# Altium schematic sheet Power_Sensing.SchDoc
size A4; DocumentNumber: 2; SheetNumber: 2; SheetTotal: 7
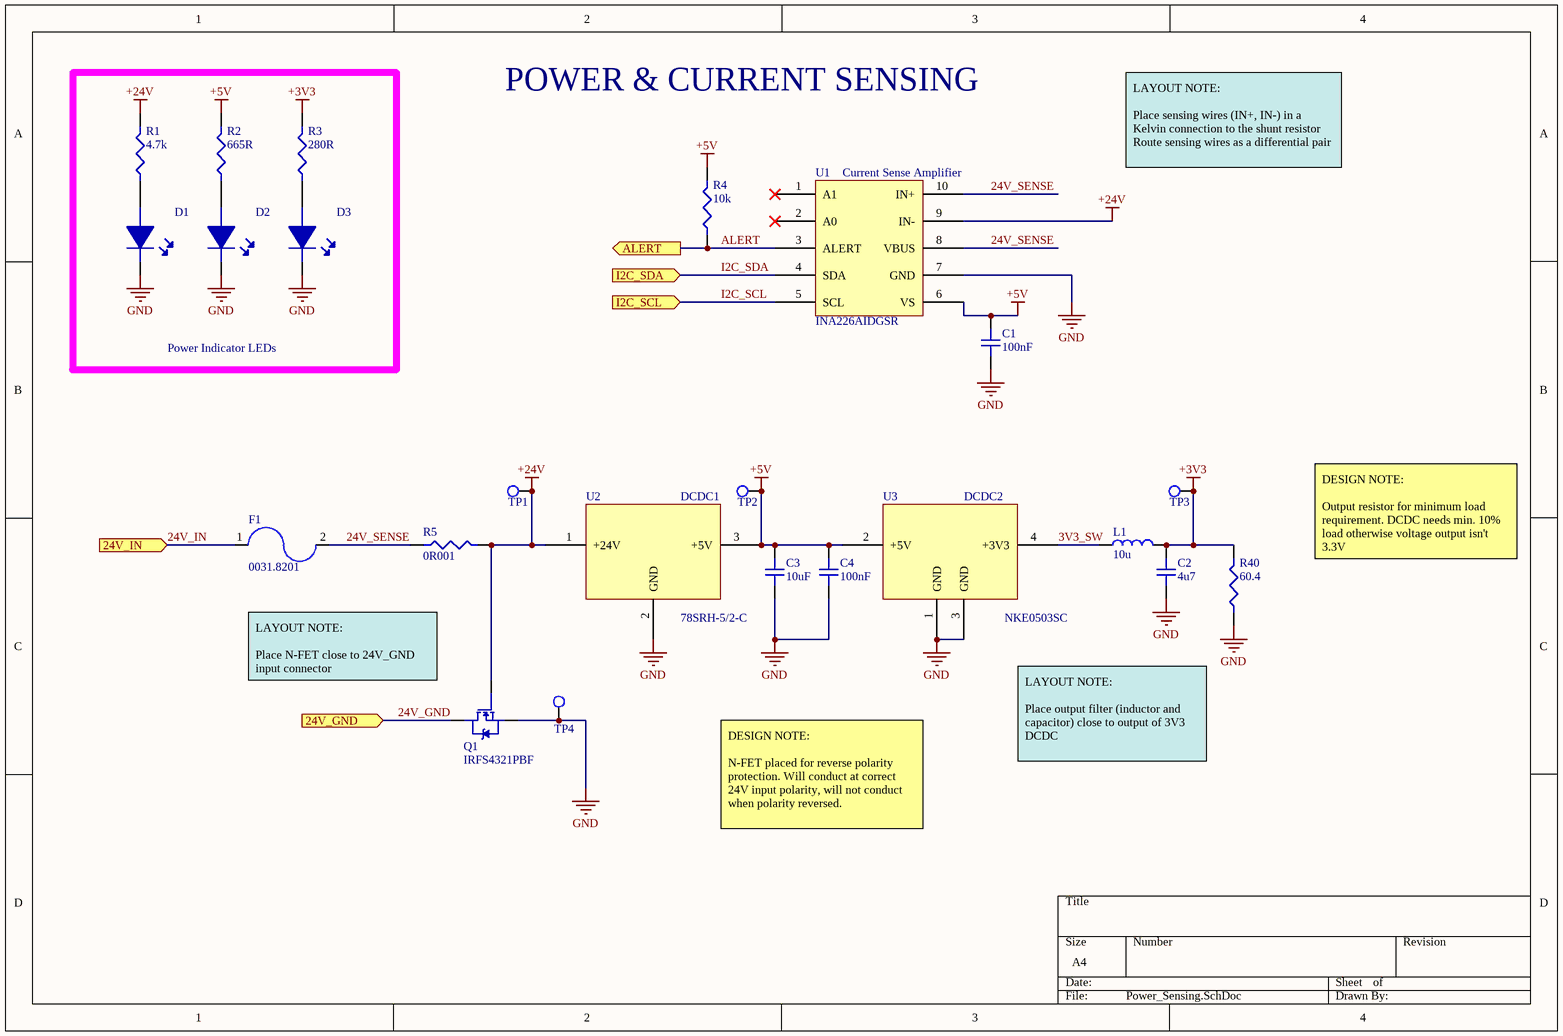
[diagram p0: Power_Sensing.SchDoc]

## Parts
C1  100nF  [C0805]
C2  4u7  [C0805]
C3  10uF  [TANT_10u]
C4  100nF  [C0805]
D1  LTST-C191KGKT  [LED_0603]  (value not drawn)
D2  LTST-C191KGKT  [LED_0603]  (value not drawn)
D3  LTST-C191KGKT  [LED_0603]  (value not drawn)
F1  0031.8201  [FUSE_HOLDER]
L1  10u  [INDUCTOR]
Q1  IRFS4321PBF  [D2PAK_FETs]
R1  4.7k  [R0805]
R2  665R  [R0805]
R3  280R  [R0805]
R4  10k  [R0805]
R5  0R001  [R2512]
R40  60.4  [R0805]
TP1  5015  [TP_HOOK]  (value not drawn)
TP2  5015  [TP_HOOK]  (value not drawn)
TP3  5015  [TP_HOOK]  (value not drawn)
TP4  5015  [TP_HOOK]  (value not drawn)
U1  INA226AIDGSR  [10-VSSOP_INA226]
U2  78SRH-5/2-C  [DCDC1]
U3  NKE0503SC  [DCDC2]

## Blocks framed on the sheet
Power Indicator LEDs: D1-D3 R1-R3

## Ports
24V_GND, 24V_IN, ALERT, I2C_SCL, I2C_SDA

## Nets
+3V3: C2.2 L1.2 R3.2 R40.2 TP3.1
+5V: C1.2 C3.2 C4.2 R2.2 R4.2 TP2.1 U1.6(VS) U2.3(+5V) U3.2(+5V)
+24V: Q1.1 R1.2 R5.2 TP1.1 U1.9(IN-) U2.1(+24V)
GND: C1.1 C2.1 C3.1 C4.1 D1.2 D2.2 D3.2 Q1.3 R40.1 TP4.1 U1.7(GND) U2.2(GND) U3.1(GND) U3.3(GND)
3V3_SW: L1.1 U3.4(+3V3)
24V_GND: Q1.4 ; port 24V_GND
24V_IN: F1.1 ; port 24V_IN
24V_SENSE: F1.2 R5.1 U1.8(VBUS) U1.10(IN+)
ALERT: R4.1 U1.3(ALERT) ; port ALERT
I2C_SCL: U1.5(SCL) ; port I2C_SCL
I2C_SDA: U1.4(SDA) ; port I2C_SDA
NetD1_1: D1.1 R1.1
NetD2_1: D2.1 R2.1
NetD3_1: D3.1 R3.1

Not connected (* = marked no-connect by the designer): U1 1(A1)* 2(A0)*

## Notes on the sheet
- POWER & CURRENT SENSING
- (near U1) Current Sense Amplifier
- LAYOUT NOTE:
  Place sensing wires (IN+, IN-) in a Kelvin connection to the shunt resistor
  Route sensing wires as a differential pair
- DCDC1
- (near U3) DCDC2
- DESIGN NOTE:
  Output resistor for minimum load requirement. DCDC needs min. 10% load otherwise voltage output isn't 3.3V
- (near Q1) LAYOUT NOTE:
  Place N-FET close to 24V_GND input connector
- LAYOUT NOTE:
  Place output filter (inductor and capacitor) close to output of 3V3 DCDC
- DESIGN NOTE:
  N-FET placed for reverse polarity protection. Will conduct at correct 24V input polarity, will not conduct when polarity reversed.

## Library data of the parts
C1 C4 = GRM21B7U1A104JA01L: MLCC SMD CAP 100nF 10Volts U2J 5%; Manufacturer: Murata; Voltage Rating: 10V; Supplier 1: Digi-Key; Manufacturer Part Number: GRM21B7U1A104JA01L; Stock 1: 6000; Pricing 1: 1=0.46, 10=0.32, 100=0.192, 500=0.144, 1000=0.1216 (USD); Mount: Surface Mount; Case/Package: 0805; Case Code (Imperial): 0805; Case Code (Metric): 2012; Min Operating Temperature: -55°C; Max Operating Temperature: 125°C; Capacitance: 100nF; Voltage Rating (DC): 10V; Tolerance: 5%; Packaging: Tape and Reel; Package Quantity: 3000; Dielectric: U2J; Termination: SMD/SMT; Length: 2mm; Height: 1.25mm; Width: 0.049inch; Thickness: 0.053inch; Depth: 1.25mm; Radiation Hardening: No; ComponentLink1URL: https://datasheet.ciiva.com/5424/product-5424660.pdf; ComponentLink1Description: https://datasheet.ciiva.com/5424/product-5424660.pdf; ComponentLink2URL: https://datasheet.ciiva.com/17451/product-17451845.pdf; ComponentLink2Description: https://datasheet.ciiva.com/17451/product-17451845.pdf; ComponentLink3URL: https://datasheet.ciiva.com/11618/product-11618924.pdf; ComponentLink3Description: https://datasheet.ciiva.com/11618/product-11618924.pdf; Supplier Part Number 1: 490-11592-6-ND
C2 = GRM219R61A475KE34D: 4.7µF ±10% 10V X5R Ceramic Capacitor -55°C ~ 85°C Surface Mount, MLCC 0805 (2012 Metric) 0.079" L x 0.049" W (2.00mm x 1.25mm); Manufacturer: Murata; Capacitance: 4.7uF; Supplier 1: Digi-Key; Manufacturer Part Number: GRM219R61A475KE34D; Stock 1: 251830; Pricing 1: 1=0.21, 10=0.152, 100=0.0716, 500=0.0502, 1000=0.0416 (USD); Mount: Surface Mount; Case/Package: 0805; Case Code (Metric): 2012; Case Code (Imperial): 0805; Min Operating Temperature: -55°C; Max Operating Temperature: 85°C; Packaging: Tape and Reel; Tolerance: 10%; Package Quantity: 4000; Voltage Rating: 10V; Voltage Rating (DC): 10V; Dielectric: X5R; Termination: SMD/SMT; Voltage: 10V; Length: 2mm; Height: 0.85mm; Width: 0.049inch; Thickness: 0.037inch; Depth: 1.25mm; Lead Free: Lead Free; ComponentLink1URL: https://datasheet.ciiva.com/169/product-169527.pdf; ComponentLink1Description: https://datasheet.ciiva.com/169/product-169527.pdf; ComponentLink2URL: https://datasheet.ciiva.com/5414/product-5414984.pdf; ComponentLink2Description: https://datasheet.ciiva.com/5414/product-5414984.pdf; ComponentLink3URL: https://datasheet.ciiva.com/16467/product-16467258.pdf; ComponentLink3Description: https://datasheet.ciiva.com/16467/product-16467258.pdf; ComponentLink4URL: https://datasheet.ciiva.com/29542/product-29542667.pdf; ComponentLink4Description: https://datasheet.ciiva.com/29542/product-29542667.pdf; ComponentLink5URL: https://datasheet.ciiva.com/29542/product-29542668.pdf; ComponentLink5Description: https://datasheet.ciiva.com/29542/product-29542668.pdf; Supplier Part Number 1: 490-3339-6-ND
C3 = F381A106MMA: AVX   F381A106MMA   Surface Mount Tantalum Capacitor, F38 Series, 10 F, 0603 [1608 Metric], 0.5 ohm, 10 V; Manufacturer: Kyocera AVX; Tolerance: 20%; ESR (Equivalent Series Resistance): 500mR; Voltage Rating: 10V; Life (Hours): 1000Hour; Dissipation Factor: 15%; Leakage Current: 10uA; Supplier 1: Digi-Key; Manufacturer Part Number: F381A106MMA; Stock 1: 7989; Pricing 1: 1=0.75, 10=0.551, 100=0.3779, 500=0.2992, 1000=0.2519 (USD); Case/Package: 0603; Weight: 7.1E-05oz; Case Code (Metric): 1608; Case Code (Imperial): 0603; Min Operating Temperature: -55°C; Max Operating Temperature: 105°C; Capacitance: 10uF; Packaging: Tape and Reel; Termination: SMD/SMT; Package Quantity: 4000; Voltage Rating (DC): 10V; Length: 1.6mm; Height: 0.8mm; Width: 0.033inch; Height - Seated (Max): 0.035inch; Depth: 0.85mm; Radiation Hardening: No; REACH SVHC: No SVHC; ComponentLink1URL: https://datasheet.ciiva.com/48510/f38-48510901.pdf; ComponentLink1Description: https://datasheet.ciiva.com/48510/f38-48510901.pdf; ComponentLink2URL: https://datasheet.ciiva.com/46417/1805432-46417517.pdf; ComponentLink2Description: https://datasheet.ciiva.com/46417/1805432-46417517.pdf; ComponentLink3URL: https://datasheet.ciiva.com/46417/1805432-46417518.pdf; ComponentLink3Description: https://datasheet.ciiva.com/46417/1805432-46417518.pdf; Supplier Part Number 1: 478-9527-1-ND
D1-D3 = LTST-C191KGKT: LED GREEN CLEAR 0603 SMD; Manufacturer: Vishay Lite-On; Lens Colour: Clear,Colorless; Power Rating: 75mW; Luminous Intensity: 35mcd; Viewing Angle: 130°; Lens Style: Clear,Diffused,Colorless,Rectangular; Forward Current: 30mA; Forward Voltage: 2V; Dominant Wavelength: 571nm; Test Current: 20mA; Number of Elements: 1; Wavelength: 574nm; Supplier 1: Digi-Key; Manufacturer Part Number: LTST-C191KGKT; Stock 1: 1301664; Pricing 1: 1=0.29, 10=0.211, 25=0.1556, 100=0.1111, 250=0.0756, 500=0.0667, 1000=0.0522, 2500=0.0511 (USD); Mount: Surface Mount; Case/Package: 0603; Number of Pins: 2; Colour: Green; Case Code (Metric): 1608; Case Code (Imperial): 0603; Min Operating Temperature: -55°C; Max Operating Temperature: 85°C; Packaging: Tape and Reel; Package Quantity: 1; Illumination Colour: Green; Lens Transparency: Clear; Power Dissipation: 75mW; Number of LEDs: 1; Length: 1.6mm; Height: 0.55mm; Width: 0.8mm; Depth: 0.8mm; Radiation Hardening: No; Lead Free: Lead Free; ComponentLink1URL: https://datasheet.ciiva.com/12400/100-ltst-c191kgkt-53586-12400818.pdf; ComponentLink1Description: https://datasheet.ciiva.com/12400/100-ltst-c191kgkt-53586-12400818.pdf; ComponentLink2URL: https://datasheet.ciiva.com/2109/s-110-ltst-c191kgkt-2109973.pdf; ComponentLink2Description: https://datasheet.ciiva.com/2109/s-110-ltst-c191kgkt-2109973.pdf; ComponentLink3URL: https://datasheet.ciiva.com/2109/s-110-ltst-c191kgkt-2109974.pdf; ComponentLink3Description: https://datasheet.ciiva.com/2109/s-110-ltst-c191kgkt-2109974.pdf; ComponentLink4URL: https://datasheet.ciiva.com/2109/s-110-ltst-c191kgkt-2109975.pdf; ComponentLink4Description: https://datasheet.ciiva.com/2109/s-110-ltst-c191kgkt-2109975.pdf; ComponentLink5URL: https://datasheet.ciiva.com/15223/getdatasheetpartid-103913-15223276.pdf; ComponentLink5Description: https://datasheet.ciiva.com/15223/getdatasheetpartid-103913-15223276.pdf; ComponentLink6URL: https://datasheet.ciiva.com/11773/0900766b80dc02b1-11773629.pdf; ComponentLink6Description: https://datasheet.ciiva.com/11773/0900766b80dc02b1-11773629.pdf; ComponentLink7URL: https://datasheet.ciiva.com/16215/ltst-c191kgkt-16215151.pdf; ComponentLink7Description: https://datasheet.ciiva.com/16215/ltst-c191kgkt-16215151.pdf; Supplier Part Number 1: 160-1446-6-ND
F1 = 0031.8201: FUSE HOLDER, PCB, 20X5MM; Manufacturer: Schurter; Colour: Black; Body Material: Thermoplastic; Material: Tin,Thermoplastic; Current Rating: 10A; Voltage Rating: 250V; Number of Poles: 1; Voltage Rating (DC): 500V; Illumination Type: Illuminated; Insulation Resistance: 40MR; Approvals: UL,CSA,IEC,EN; Supplier 1: Digi-Key; Manufacturer Part Number: 0031.8201; Stock 1: 38678; Pricing 1: 1=0.63, 10=0.589, 20=0.548, 50=0.4932, 100=0.4658, 200=0.4384, 500=0.411, 1000=0.3836, 5000=0.3644 (USD); Mount: Through Hole,PCB; Weight: 0.059966oz; Contact Material: Tin,Copper Alloy; Contact Plating: Tin; Min Operating Temperature: -40°C; Max Operating Temperature: 85°C; Packaging: Bulk; Package Quantity: 100; Voltage Rating (AC): 500V; Number of Circuits: 1; Voltage: 500V; Termination: PC Pin; Fuse Current: 10A; Orientation: Horizontal; Length: 25mm; Depth: 10.8mm; Radiation Hardening: No; REACH SVHC: No SVHC; Lead Free: Lead Free; Flammability Rating: UL94 V-0; ComponentLink1URL: https://datasheet.ciiva.com/3014/typ-ogn-3014480.pdf; ComponentLink1Description: https://datasheet.ciiva.com/3014/typ-ogn-3014480.pdf; ComponentLink2URL: https://datasheet.ciiva.com/1269/1842496-1269251.pdf; ComponentLink2Description: https://datasheet.ciiva.com/1269/1842496-1269251.pdf; ComponentLink3URL: https://datasheet.ciiva.com/15188/getdatasheetpartid-392104-15188042.pdf; ComponentLink3Description: https://datasheet.ciiva.com/15188/getdatasheetpartid-392104-15188042.pdf; ComponentLink4URL: https://datasheet.ciiva.com/16203/typ-ogn-16203626.pdf; ComponentLink4Description: https://datasheet.ciiva.com/16203/typ-ogn-16203626.pdf; ComponentLink5URL: https://datasheet.ciiva.com/16463/typ-ogn-16463850.pdf; ComponentLink5Description: https://datasheet.ciiva.com/16463/typ-ogn-16463850.pdf; ComponentLink6URL: https://datasheet.ciiva.com/16215/typ-ogn-16215099.pdf; ComponentLink6Description: https://datasheet.ciiva.com/16215/typ-ogn-16215099.pdf; ComponentLink7URL: https://datasheet.ciiva.com/25893/typ-ogn-25893934.pdf; ComponentLink7Description: https://datasheet.ciiva.com/25893/typ-ogn-25893934.pdf; Supplier Part Number 1: 486-1258-ND
L1 = 82103C: Fixed Inductors 10uH 0.5A Mini SMT Power; Manufacturer: Murata; Tolerance: 10%; Self Resonant Frequency: 38MHz; Q Factor: 35; Current Rating: 500mA; Shielding: Unshielded; DC Resistance (DCR): 400mR; Test Frequency: 10KHz; Supplier 1: Digi-Key; Manufacturer Part Number: 82103C; Stock 1: 1668; Pricing 1: 1=0.32, 100=0.2906 (USD); Mount: Surface Mount; Case/Package: 1210; Case Code (Metric): 3225; Case Code (Imperial): 1210; Min Operating Temperature: -40°C; Max Operating Temperature: 85°C; Packaging: Tape and Reel; Package Quantity: 1; Composition: Wirewound; Inductance: 10uh; Max DC Current: 500mA; Termination: SMD/SMT; DC Current: 500mA; Military Standard: Not; Length: 0.126inch; Height: 2mm; Width: 0.098inch; Height - Seated (Max): 0.092inch; Depth: 2.7mm; Radiation Hardening: No; ComponentLink1URL: https://datasheet.ciiva.com/6690/kmp-8200c-6690973.pdf; ComponentLink1Description: https://datasheet.ciiva.com/6690/kmp-8200c-6690973.pdf; ComponentLink2URL: https://datasheet.ciiva.com/6690/kmp-8200c-6690974.pdf; ComponentLink2Description: https://datasheet.ciiva.com/6690/kmp-8200c-6690974.pdf; ComponentLink3URL: https://datasheet.ciiva.com/6690/kmp-8200c-6690975.pdf; ComponentLink3Description: https://datasheet.ciiva.com/6690/kmp-8200c-6690975.pdf; Supplier Part Number 1: 811-2473-6-ND
Q1 = IRFS4321PBF: MOSFET  N Channel, 83 A, 150 V, 0.012 ohm, 10 V, 5 V; Manufacturer: Infineon; Drain to Source Voltage (Vdss): 150V; Continuous Drain Current (ID): 85A; Rds On Max: 15mR; Input Capacitance: 4.46nF; Max Power Dissipation: 350W; Threshold Voltage: 5V; Supplier 1: Digi-Key; Manufacturer Part Number: IRFS4321PBF; Stock 1: 1426; Pricing 1: 1=3.12, 10=2.804, 100=2.2973, 500=1.9556, 1000=1.6493 (USD); Mount: Surface Mount; Case/Package: TO-263-3; Number of Pins: 3; Min Operating Temperature: -55°C; Max Operating Temperature: 175°C; Packaging: Rail/Tube; REACH SVHC: No SVHC; Lead Free: Lead Free; ComponentLink1URL: http://www.farnell.com/datasheets/1308989.pdf; ComponentLink1Description: http://www.farnell.com/datasheets/1308989.pdf; Supplier Part Number 1: IRFS4321PBF-ND
R1 = RC0805FR-074K7L: RES SMD 4.7K OHM 1% 1/8W 0805; Manufacturer: Yageo; Resistance: 4.7KR; Temperature Coefficient: 100ppm/°C; Power Rating: 125mW; Voltage Rating: 150V; Supplier 1: Digi-Key; Manufacturer Part Number: RC0805FR-074K7L; Stock 1: 2632902; Pricing 1: 1=0.1, 10=0.022, 100=0.0088, 1000=0.004, 2500=0.0034 (USD); Case/Package: 0805; Number of Pins: 2; Case Code (Metric): 2012; Case Code (Imperial): 0805; Min Operating Temperature: -55°C; Max Operating Temperature: 155°C; Packaging: Tape and Reel; Tolerance: 1%; Composition: Thick Film; Voltage Rating (DC): 150V; Termination: SMD/SMT; Military Standard: Not; Package Quantity: 5000; Number of Terminations: 2; Max Power Dissipation: 125mW; Length: 0.079inch; Height: 0.024inch; Width: 0.049inch; Depth: 1.25mm; REACH SVHC: No SVHC; Lead Free: Lead Free; ComponentLink1URL: https://datasheet.ciiva.com/11808/0900766b8106beab-11808155.pdf; ComponentLink1Description: https://datasheet.ciiva.com/11808/0900766b8106beab-11808155.pdf; ComponentLink2URL: https://datasheet.ciiva.com/7941/444164-7941804.pdf; ComponentLink2Description: https://datasheet.ciiva.com/7941/444164-7941804.pdf; ComponentLink3URL: https://datasheet.ciiva.com/7941/1686128-7941805.pdf; ComponentLink3Description: https://datasheet.ciiva.com/7941/1686128-7941805.pdf; ComponentLink4URL: https://datasheet.ciiva.com/7941/444164-7941806.pdf; ComponentLink4Description: https://datasheet.ciiva.com/7941/444164-7941806.pdf; ComponentLink5URL: https://datasheet.ciiva.com/6547/pyu-r-int-thick-7-6547263.pdf; ComponentLink5Description: https://datasheet.ciiva.com/6547/pyu-r-int-thick-7-6547263.pdf; ComponentLink6URL: https://datasheet.ciiva.com/46447/444164-46447583.pdf; ComponentLink6Description: https://datasheet.ciiva.com/46447/444164-46447583.pdf; Supplier Part Number 1: 311-4.70KCRDKR-ND
R2 = RC0805FR-07665RL: RES SMD 665 OHM 1% 1/8W 0805; Manufacturer: Yageo; Power Rating: 125mW; Temperature Coefficient: 100ppm/°C; Voltage Rating (DC): 150V; Supplier 1: Digi-Key; Manufacturer Part Number: RC0805FR-07665RL; Stock 1: 51898; Pricing 1: 1=0.1, 10=0.022, 100=0.0088, 1000=0.004, 2500=0.0034 (USD); Case/Package: 0805; Case Code (Imperial): 0805; Case Code (Metric): 2012; Min Operating Temperature: -55°C; Max Operating Temperature: 155°C; Resistance: 665R; Tolerance: 1%; Packaging: Tape and Reel; Composition: Thick Film; Package Quantity: 1; Voltage Rating: 150V; Termination: SMD/SMT; Number of Terminations: 2; Military Standard: Not; Max Power Dissipation: 125mW; Length: 2mm; Height: 0.024inch; Width: 1.25mm; Depth: 1.25mm; Lead Free: Lead Free; ComponentLink1URL: https://datasheet.ciiva.com/17423/rc0805-17423095.pdf; ComponentLink1Description: https://datasheet.ciiva.com/17423/rc0805-17423095.pdf; ComponentLink2URL: https://datasheet.ciiva.com/12561/rc0805-257173-12561528.pdf; ComponentLink2Description: https://datasheet.ciiva.com/12561/rc0805-257173-12561528.pdf; ComponentLink3URL: https://datasheet.ciiva.com/2457/pyu-r-int-thick-7-2457788.pdf; ComponentLink3Description: https://datasheet.ciiva.com/2457/pyu-r-int-thick-7-2457788.pdf; ComponentLink4URL: https://datasheet.ciiva.com/2457/pyu-r-int-thick-7-2457789.pdf; ComponentLink4Description: https://datasheet.ciiva.com/2457/pyu-r-int-thick-7-2457789.pdf; ComponentLink5URL: https://datasheet.ciiva.com/2457/pyu-r-int-thick-7-2457790.pdf; ComponentLink5Description: https://datasheet.ciiva.com/2457/pyu-r-int-thick-7-2457790.pdf; Supplier Part Number 1: 311-665CRDKR-ND
R3 = RC0805FR-07280RL: RES SMD 280 OHM 1% 1/8W 0805; Manufacturer: Yageo; Temperature Coefficient: 100ppm/°C; Max Power Dissipation: 125mW; Voltage Rating (DC): 150V; Supplier 1: Digi-Key; Manufacturer Part Number: RC0805FR-07280RL; Stock 1: 117224; Pricing 1: 1=0.1, 10=0.022, 100=0.0088, 1000=0.004, 2500=0.0034 (USD); Case/Package: 0805; Case Code (Imperial): 0805; Case Code (Metric): 2012; Min Operating Temperature: -55°C; Max Operating Temperature: 155°C; Package Quantity: 1; Resistance: 280R; Tolerance: 1%; Packaging: Tape and Reel; Composition: Thick Film; Number of Terminations: 2; Power Rating: 125mW; Voltage Rating: 150V; Termination: SMD/SMT; Military Standard: Not; Length: 2mm; Height: 0.024inch; Width: 1.25mm; Depth: 1.25mm; Lead Free: Lead Free; ComponentLink1URL: https://datasheet.ciiva.com/12558/rc0805-257173-12558854.pdf; ComponentLink1Description: https://datasheet.ciiva.com/12558/rc0805-257173-12558854.pdf; ComponentLink2URL: https://datasheet.ciiva.com/17423/rc0805-17423226.pdf; ComponentLink2Description: https://datasheet.ciiva.com/17423/rc0805-17423226.pdf; ComponentLink3URL: https://datasheet.ciiva.com/2457/pyu-r-int-thick-7-2457389.pdf; ComponentLink3Description: https://datasheet.ciiva.com/2457/pyu-r-int-thick-7-2457389.pdf; ComponentLink4URL: https://datasheet.ciiva.com/2457/pyu-r-int-thick-7-2457390.pdf; ComponentLink4Description: https://datasheet.ciiva.com/2457/pyu-r-int-thick-7-2457390.pdf; ComponentLink5URL: https://datasheet.ciiva.com/2457/pyu-r-int-thick-7-2457391.pdf; ComponentLink5Description: https://datasheet.ciiva.com/2457/pyu-r-int-thick-7-2457391.pdf; Supplier Part Number 1: 311-280CRCT-ND
R4 = RC0805FR-071KL: RES SMD 10K OHM 1% 1/8W 0805; Manufacturer: Yageo Phycomp; Temperature Coefficient: 100ppm/°C; Resistance: 1KR; Voltage Rating (DC): 150V; Power Rating: 125mW; Supplier 1: Digi-Key; Manufacturer Part Number: RC0805FR-071KL; Stock 1: 5527973; Pricing 1: 1=0.1, 10=0.022, 100=0.0088, 1000=0.004, 2500=0.0034 (USD); Case/Package: 0805; Number of Pins: 2; Min Operating Temperature: -55°C; Max Operating Temperature: 155°C; Tolerance: 1%; Packaging: Cut Tape; Length: 2mm; Height: 0.5mm; Width: 1.25mm; Depth: 1.25mm; REACH SVHC: No SVHC; Lead Free: Lead Free
R5 = ERJ-M1WTF1M0U: Res Thick Film 2512 0.001 Ohm 1% 1W 250ppm/C to 450ppm/C Molded SMD Embossed Carrier T/R; Manufacturer: Panasonic ECG; Resistance: 1mR; Temperature Coefficient: 450ppm/°C; Supplier 1: Digi-Key; Manufacturer Part Number: ERJ-M1WTF1M0U; Stock 1: 36740; Pricing 1: 1=0.55, 10=0.456, 25=0.3908, 50=0.3516, 100=0.3061, 250=0.2735, 500=0.2214, 1000=0.1791 (USD); Mount: Surface Mount; Case/Package: 2512; Number of Pins: 2; Case Code (Metric): 6432; Case Code (Imperial): 2512; Contact Plating: Tin; Min Operating Temperature: -55°C; Max Operating Temperature: 170°C; Package Quantity: 1; Packaging: Tape and Reel; Power Rating: 1W; Tolerance: 1%; Composition: Thick Film,Metal Strip,Metal Element; Number of Terminations: 2; Termination: SMD/SMT; Military Standard: Not; Max Power Dissipation: 1W; Length: 6.4mm; Height: 0.8mm; Width: 0.126inch; Depth: 3.2mm; Radiation Hardening: No; REACH SVHC: No SVHC; Lead Free: Lead Free; ComponentLink1URL: https://datasheet.ciiva.com/11811/0900766b80befc3b-11811491.pdf; ComponentLink1Description: https://datasheet.ciiva.com/11811/0900766b80befc3b-11811491.pdf; ComponentLink2URL: https://datasheet.ciiva.com/9198/aoa0000ce7-9198885.pdf; ComponentLink2Description: https://datasheet.ciiva.com/9198/aoa0000ce7-9198885.pdf; ComponentLink3URL: https://datasheet.ciiva.com/7777/39800-7777943.pdf; ComponentLink3Description: https://datasheet.ciiva.com/7777/39800-7777943.pdf; ComponentLink4URL: https://datasheet.ciiva.com/16216/aoa0000ce7-16216983.pdf; ComponentLink4Description: https://datasheet.ciiva.com/16216/aoa0000ce7-16216983.pdf; ComponentLink5URL: https://datasheet.ciiva.com/24072/aoa0000ce7-60136-24072248.pdf; ComponentLink5Description: https://datasheet.ciiva.com/24072/aoa0000ce7-60136-24072248.pdf; ComponentLink6URL: https://datasheet.ciiva.com/16512/aoa0000ce7-16512553.pdf; ComponentLink6Description: https://datasheet.ciiva.com/16512/aoa0000ce7-16512553.pdf; ComponentLink7URL: https://datasheet.ciiva.com/16788/70260812-16788394.pdf; ComponentLink7Description: https://datasheet.ciiva.com/16788/70260812-16788394.pdf; ComponentLink8URL: https://datasheet.ciiva.com/5996/39800-5996507.pdf; ComponentLink8Description: https://datasheet.ciiva.com/5996/39800-5996507.pdf; ComponentLink9URL: https://datasheet.ciiva.com/17215/aoa0000ce7-17215229.pdf; ComponentLink9Description: https://datasheet.ciiva.com/17215/aoa0000ce7-17215229.pdf; ComponentLink10URL: https://datasheet.ciiva.com/30206/aoa0000ce7-30206797.pdf; ComponentLink10Description: https://datasheet.ciiva.com/30206/aoa0000ce7-30206797.pdf; ComponentLink11URL: https://datasheet.ciiva.com/16785/70260812-16785566.pdf; ComponentLink11Description: https://datasheet.ciiva.com/16785/70260812-16785566.pdf; Supplier Part Number 1: P1.0NDCT-ND
R40 = RC0805FR-0760R4L: RES SMD 60.4 OHM 1% 1/8W 0805; Manufacturer: Yageo; Resistance: 60.4R; Power Rating: 125mW; Temperature Coefficient: 100ppm/°C; Voltage Rating (DC): 150V; Supplier 1: Digi-Key; Manufacturer Part Number: RC0805FR-0760R4L; Stock 1: 189238; Pricing 1: 1=0.1, 10=0.022, 100=0.0088, 1000=0.004, 2500=0.0034 (USD); Case/Package: 0805; Case Code (Metric): 2012; Case Code (Imperial): 0805; Contact Plating: Tin,Lead,Matte; Min Operating Temperature: -55°C; Max Operating Temperature: 155°C; Package Quantity: 1; Tolerance: 1%; Packaging: Tape and Reel; Composition: Thick Film; Military Standard: Not; Voltage Rating: 150V; Number of Terminations: 2; Termination: SMD/SMT; Max Power Dissipation: 125mW; Length: 0.079inch; Height: 0.024inch; Width: 0.049inch; Depth: 1.25mm; Radiation Hardening: No; Lead Free: Lead Free; ComponentLink1URL: https://datasheet.ciiva.com/2457/pyu-r-int-thick-7-2457216.pdf; ComponentLink1Description: https://datasheet.ciiva.com/2457/pyu-r-int-thick-7-2457216.pdf; ComponentLink2URL: https://datasheet.ciiva.com/2457/pyu-r-int-thick-7-2457217.pdf; ComponentLink2Description: https://datasheet.ciiva.com/2457/pyu-r-int-thick-7-2457217.pdf; ComponentLink3URL: https://datasheet.ciiva.com/2457/pyu-r-int-thick-7-2457215.pdf; ComponentLink3Description: https://datasheet.ciiva.com/2457/pyu-r-int-thick-7-2457215.pdf; Supplier Part Number 1: 311-60.4CRDKR-ND
TP1-TP4 = 5015: TEST POINT, PCB, SMT; Manufacturer: Keystone Electronics; Number of Ports: 1; Supplier 1: Digi-Key; Manufacturer Part Number: 5015; Stock 1: 1937775; Pricing 1: 1=0.44, 10=0.421, 25=0.3604, 50=0.3064, 100=0.2944, 250=0.2644, 500=0.2524 (USD); Mount: Surface Mount; Colour: White; Contact Material: Bronze; Contact Plating: Tin,Silver,Lead; Material: Bronze,Silver; Package Quantity: 1; Packaging: Tape and Reel; Termination: Solder; Orientation: Straight; Length: 2.66mm; Height: 0.06inch; Thickness: 0.01inch; Depth: 1.01mm; REACH SVHC: No SVHC; Lead Free: Lead Free; ComponentLink1URL: https://datasheet.ciiva.com/2917/5015-2917616.pdf; ComponentLink1Description: https://datasheet.ciiva.com/2917/5015-2917616.pdf; ComponentLink2URL: https://datasheet.ciiva.com/2917/5015-2917617.pdf; ComponentLink2Description: https://datasheet.ciiva.com/2917/5015-2917617.pdf; ComponentLink3URL: https://datasheet.ciiva.com/1123/5015-1123862.pdf; ComponentLink3Description: https://datasheet.ciiva.com/1123/5015-1123862.pdf; ComponentLink4URL: https://datasheet.ciiva.com/16883/70182998-16883734.pdf; ComponentLink4Description: https://datasheet.ciiva.com/16883/70182998-16883734.pdf; Supplier Part Number 1: 36-5015CT-ND
U1 = INA226AIDGSR: IC MONITOR PWR/CURR BIDIR 10MSOP; Manufacturer: Texas Instruments; Min Supply Voltage: 2.7V; Max Supply Voltage: 5.5V; Nominal Supply Current: 330uA; Common Mode Rejection Ratio: 140dB; Output Current: 10mA; Input Bias Current: 10uA; Input Offset Voltage (Vos): 2.5uV; Accuracy: 0.02%; Supplier 1: Digi-Key; Manufacturer Part Number: INA226AIDGSR; Stock 1: 62674; Pricing 1: 1=2.95, 10=2.648, 100=2.1692, 500=1.8466, 1000=1.5574 (USD); Mount: Surface Mount; Case/Package: VSSOP; Number of Pins: 10; Contact Plating: Gold; Min Operating Temperature: -40°C; Max Operating Temperature: 125°C; Packaging: Tape and Reel; Package Quantity: 1; Radiation Hardening: No; REACH SVHC: No SVHC; Lead Free: Lead Free; ComponentLink1URL: https://datasheet.ciiva.com/1939/ina226-1939633.pdf; ComponentLink1Description: https://datasheet.ciiva.com/1939/ina226-1939633.pdf; ComponentLink2URL: https://datasheet.ciiva.com/1939/ina226-1939634.pdf; ComponentLink2Description: https://datasheet.ciiva.com/1939/ina226-1939634.pdf; ComponentLink3URL: https://datasheet.ciiva.com/1939/ina226-1939635.pdf; ComponentLink3Description: https://datasheet.ciiva.com/1939/ina226-1939635.pdf; ComponentLink4URL: https://datasheet.ciiva.com/14196/ina226-14196741.pdf; ComponentLink4Description: https://datasheet.ciiva.com/14196/ina226-14196741.pdf; ComponentLink5URL: https://datasheet.ciiva.com/4875/sbos547-126280-4875559.pdf; ComponentLink5Description: https://datasheet.ciiva.com/4875/sbos547-126280-4875559.pdf; ComponentLink6URL: https://datasheet.ciiva.com/22693/1840205-22693516.pdf; ComponentLink6Description: https://datasheet.ciiva.com/22693/1840205-22693516.pdf; Supplier Part Number 1: 296-29034-1-ND
U2 = 78SRH-5/2-C: MURATA POWER SOLUTIONS 	   	78SRH-5/2-C 	   	IC, SYNC SWITCHING REGULATOR, TO-220-3; Output Current: 2A; Output Voltage: 5V; Number of Outputs: 1; Max Input Voltage: 32V; Min Input Voltage: 8V; Nominal Input Voltage: 12V; Output Power: 10W; Efficiency: 95%; Isolation: Isolated; Supplier 1: Digi-Key; Manufacturer: Murata; Manufacturer Part Number: 78SRH-5/2-C; Stock 1: 2978; Pricing 1: 1=13.95, 5=12.2, 10=10.959 (USD); Mount: Through Hole; Case/Package: SIP; Number of Pins: 3; Weight: 1lb; Min Operating Temperature: -40°C; Max Operating Temperature: 70°C; Packaging: Box; Max Output Current: 2A; Nominal Output Voltage: 5V; Min Input Voltage (DC): 8V; Package Quantity: 144; Max Input Voltage (DC): 32V; Voltage - Output 1: 5V; Current - Output 1: 2A; Max Output Power: 10W; Max Power Dissipation: 10W; Length: 20.3mm; Height: 0.28inch; Width: 0.8inch; Depth: 7.1mm; Radiation Hardening: No; REACH SVHC: No SVHC; Lead Free: Lead Free; ComponentLink1URL: https://datasheet.ciiva.com/3240/mpm-78sr-2a-a00-3240576.pdf; ComponentLink1Description: https://datasheet.ciiva.com/3240/mpm-78sr-2a-a00-3240576.pdf; ComponentLink2URL: https://datasheet.ciiva.com/1170/698935-1170225.pdf; ComponentLink2Description: https://datasheet.ciiva.com/1170/698935-1170225.pdf; ComponentLink3URL: https://datasheet.ciiva.com/26809/getdatasheetpartid-357559-26809336.pdf; ComponentLink3Description: https://datasheet.ciiva.com/26809/getdatasheetpartid-357559-26809336.pdf; ComponentLink4URL: https://datasheet.ciiva.com/16627/mpm-78sr-2a-a00-16627849.pdf; ComponentLink4Description: https://datasheet.ciiva.com/16627/mpm-78sr-2a-a00-16627849.pdf; ComponentLink5URL: https://datasheet.ciiva.com/16405/mpm-78sr-2a-a00-16405759.pdf; ComponentLink5Description: https://datasheet.ciiva.com/16405/mpm-78sr-2a-a00-16405759.pdf; Supplier Part Number 1: 811-2657-ND
U3 = NKE0503SC: DC/DC CONVERTER 3.3V 1W; Manufacturer: Murata; Output Current: 303mA; Number of Outputs: 1; Min Input Voltage (DC): 4.5V; Max Input Voltage (DC): 5.5V; Efficiency: 74%; Nominal Input Voltage: 5V; Isolation Voltage: 3kV; Isolation: Isolated; Supplier 1: Digi-Key; Manufacturer Part Number: NKE0503SC; Stock 1: 748; Pricing 1: 1=7.61, 5=7.57, 10=7.52, 25=7.43, 50=7.25, 100=6.89, 250=6.45, 500=6.01, 1000=5.985 (USD); Mount: Through Hole; Case/Package: SIP; Number of Pins: 4; Min Operating Temperature: -40°C; Max Operating Temperature: 85°C; Packaging: Rail/Tube; Package Quantity: 40; Output Voltage: 3.3V; Output Power: 1W; Max Output Current: 303mA; Nominal Output Voltage: 3.3V; Max Input Voltage: 5.5V; Min Input Voltage: 4.5V; Voltage - Output 1: 3.3V; Current - Output 1: 303mA; Max Output Power: 1W; Max Power Dissipation: 1W; Length: 11.48mm; Height: 7.46mm; Width: 6mm; Depth: 6mm; Radiation Hardening: No; REACH SVHC: No SVHC; Flammability Rating: UL94 V-0; ComponentLink1URL: https://datasheet.ciiva.com/18018/getdatasheetpartid-363088-18018901.pdf; ComponentLink1Description: https://datasheet.ciiva.com/18018/getdatasheetpartid-363088-18018901.pdf; ComponentLink2URL: https://datasheet.ciiva.com/16627/kdc-nke-16627961.pdf; ComponentLink2Description: https://datasheet.ciiva.com/16627/kdc-nke-16627961.pdf; ComponentLink3URL: https://datasheet.ciiva.com/2169/kdc-nke-2169402.pdf; ComponentLink3Description: https://datasheet.ciiva.com/2169/kdc-nke-2169402.pdf; ComponentLink4URL: https://datasheet.ciiva.com/8011/1790387-8011754.pdf; ComponentLink4Description: https://datasheet.ciiva.com/8011/1790387-8011754.pdf; ComponentLink5URL: https://datasheet.ciiva.com/29186/158161-da-01-en-dc-dc-wandler-nke0503sc-mps-29186131.pdf; ComponentLink5Description: https://datasheet.ciiva.com/29186/158161-da-01-en-dc-dc-wandler-nke0503sc-mps-29186131.pdf; Supplier Part Number 1: 811-1432-5-ND